# Altium schematic sheet Dynamixel AX adapter.SchDoc
size A
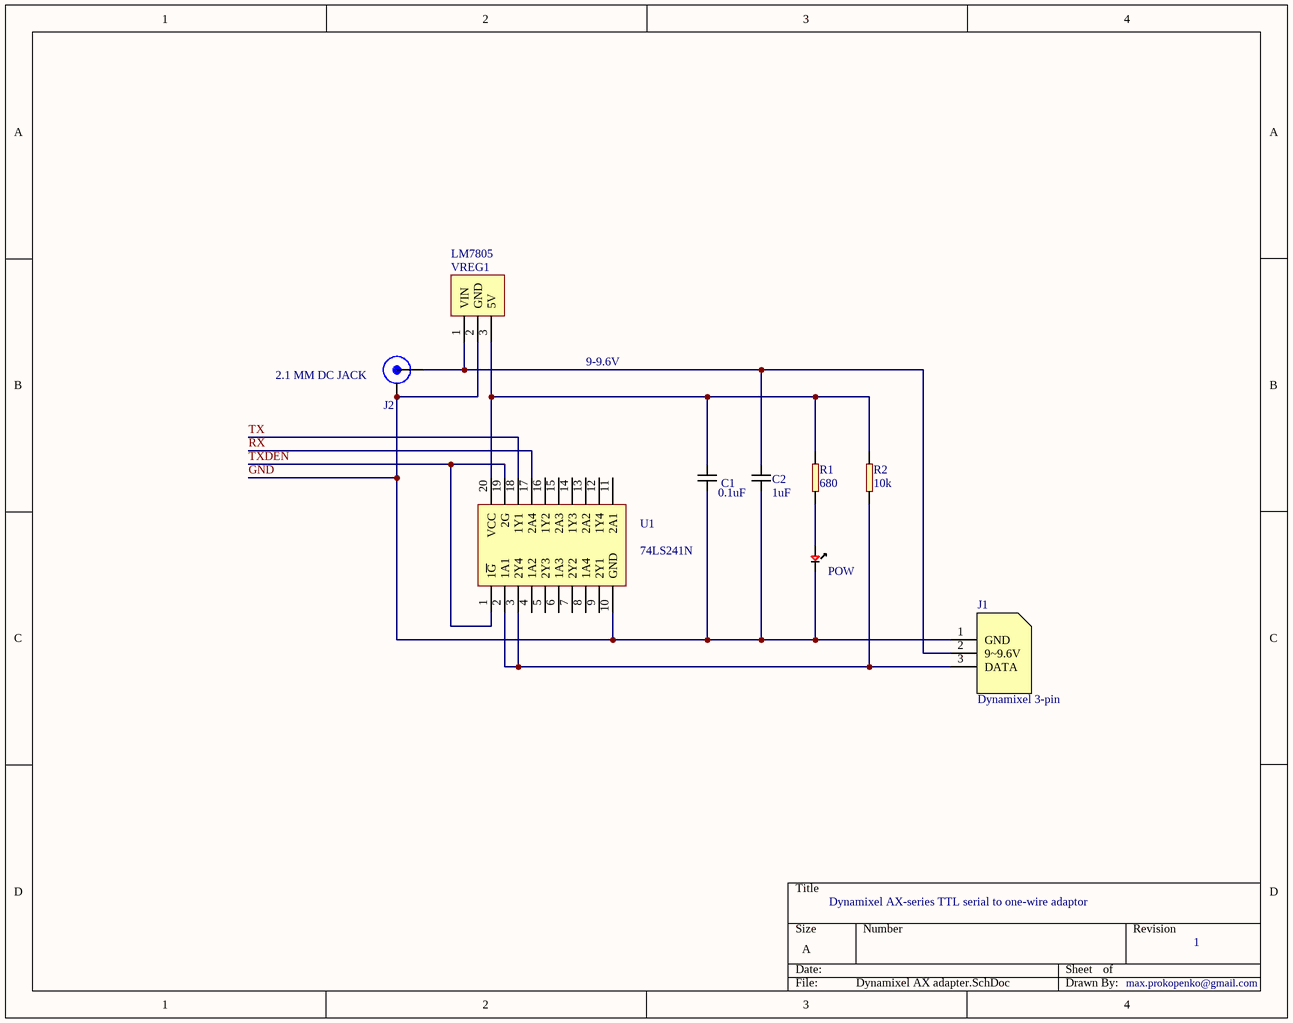
[diagram p0: Dynamixel AX adapter.SchDoc]

## Parts
C1  C: 0.1uF  [0603]  (hidden comment: C 0.1uF 25V)
C2  C: 1uF  [0603]  (hidden comment: C 1uF 25V)
J1  Dynamixel 3-pin  [DYNAMIXEL 3-PIN]
J2  2.1 MM DC JACK  VIN: 9-9.6V  [DC JACK 2.1MM SMT]
POW  LEDG  [0805 - LED]  (value not drawn)
R1  R: 680  [0603]  (hidden comment: R 680)
R2  R: 10k  [0603]  (hidden comment: R 10k)
U1  74LS241N
VREG1  LM7805

## Nets
GND: C1.2 C2.2 J1.1(GND) J2.2(G) POW.2(K) U1.10(GND) VREG1.2(GND)
RX: U1.17(2A4)
TX: U1.18(1Y1)
TXDEN: U1.1(1~{G}) U1.19(2G)
NetC1_1: C1.1 R1.1 R2.1 U1.20(VCC) VREG1.3(5V)
NetC2_1: C2.1 J1.2(9~9.6V) J2.1(S) VREG1.1(VIN)
NetJ1_3: J1.3(DATA) R2.2 U1.2(1A1) U1.3(2Y4)
NetPOW_1: POW.1(A) R1.2

Not connected (* = marked no-connect by the designer): U1 4(1A2) 5(2Y3) 6(1A3) 7(2Y2) 8(1A4) 9(2Y1) 11(2A1) 12(1Y4) 13(2A2) 14(1Y3) 15(2A3) 16(1Y2)

## Notes on the sheet
- Dynamixel AX-series TTL serial to one-wire adaptor
- 1
- max.prokopenko@gmail.com

## Library data of the parts
J2 = SMT 2.1MM DC JACK: Supplier 1: Digi-Key; Supplier Part Number 1: CP-002AHPJCT-ND
C1 = C 0.1uF 25V: Supplier 1: Digi-Key; Supplier Part Number 1: 445-1316-1-ND
C2 = C 1uF 25V: Supplier 1: Digi-Key; Supplier Part Number 1: 1276-1858-1-ND
J1 = Dynamixel 3-pin: Supplier 1: Digi-Key; Supplier Part Number 1: WM18887-ND
POW = LEDG: Supplier 1: Digi-Key; Supplier Part Number 1: 160-1423-1-ND
R1 = R 680: Supplier 1: Digi-Key; Supplier Part Number 1: 311-680GRCT-ND
R2 = R 10k: Supplier 1: Digi-Key; Supplier Part Number 1: 311-10KGRCT-ND